# Altium schematic sheet Power.SchDoc
size Letter
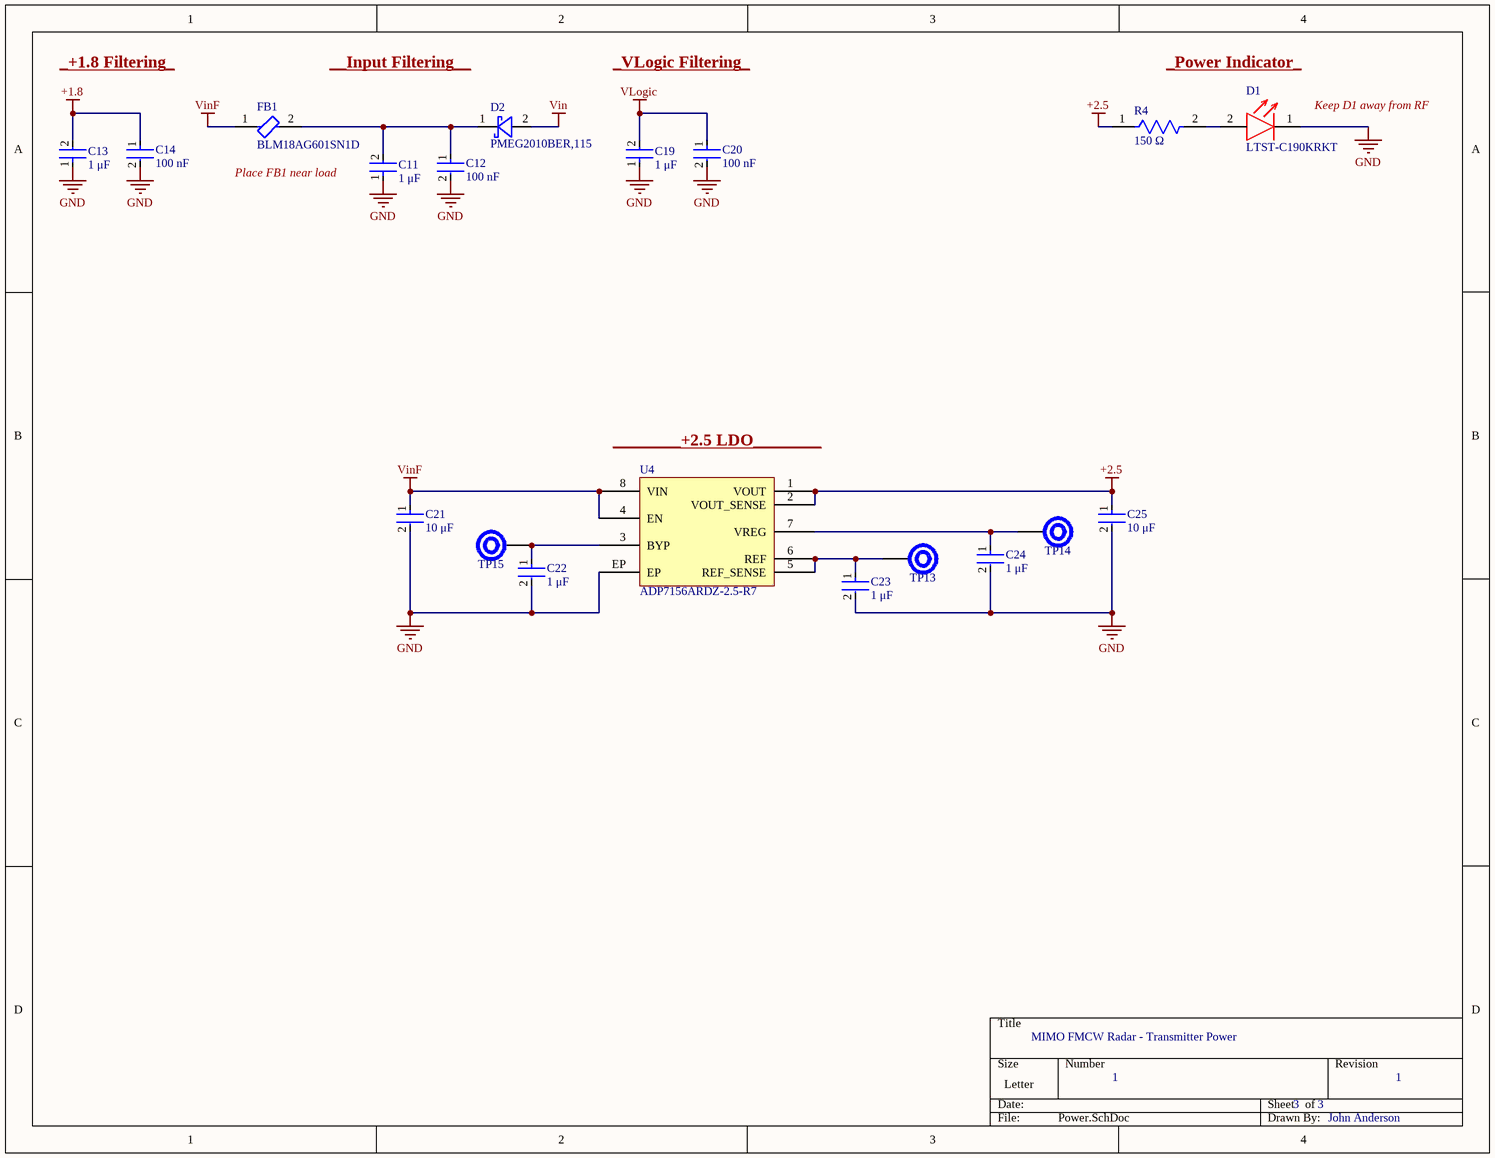
[diagram p0: Power.SchDoc]

## Parts
C11  1 μF  [FP-0603-L_1_6_0_15-W_0_8-MFG]
C12  100 nF  [FP-CGA3E-0_3-0_1-MFG]
C13  1 μF  [FP-0603-L_1_6_0_15-W_0_8-MFG]
C14  100 nF  [FP-CGA3E-0_3-0_1-MFG]
C19  1 μF  [FP-0603-L_1_6_0_15-W_0_8-MFG]
C20  100 nF  [FP-CGA3E-0_3-0_1-MFG]
C21  10 μF  [FP-GRM21B-0_15-IPC_C]
C22  1 μF  [FP-0603-L_1_6_0_15-W_0_8-MFG]
C23  1 μF  [FP-0603-L_1_6_0_15-W_0_8-MFG]
C24  1 μF  [FP-0603-L_1_6_0_15-W_0_8-MFG]
C25  10 μF  [FP-GRM21B-0_15-IPC_C]
D1  LTST-C190KRKT  [LTST-C190KRKT-Footprint-1]
D2  PMEG2010BER,115  [PMEG2010BER,115-Footprint-1]
FB1  BLM18AG601SN1D  [FP-BLM18-0_15-t0_8-IPC_B]
R4  150 Ω  [FP-RMCF0603-IPC_C]
TP13  Test Point - 32 mil  [Test Point - 32 mil-Footprint-1]  (value not drawn)
TP14  Test Point - 32 mil  [Test Point - 32 mil-Footprint-1]  (value not drawn)
TP15  Test Point - 32 mil  [Test Point - 32 mil-Footprint-1]  (value not drawn)
U4  ADP7156ARDZ-2.5-R7  [ADP7156ARDZ-2.5-R7-Footprint-1]

## Nets
+1.8: C13.2 C14.1
+2.5: C25.1 R4.1 U4.1(VOUT) U4.2(VOUT_SENSE)
GND: C11.1 C12.2 C13.1 C14.2 C19.1 C20.2 C21.2 C22.2 C23.2 C24.2 C25.2 D1.1 U4.EP
Vin: D2.2
VinF: C21.1 FB1.1 U4.4(EN) U4.8(VIN)
VLogic: C19.2 C20.1
NetC11_2: C11.2 C12.1 D2.1 FB1.2
NetC22_1: C22.1 TP15.1 U4.3(BYP)
NetC23_1: C23.1 TP13.1 U4.5(REF_SENSE) U4.6(REF)
NetC24_1: C24.1 TP14.1 U4.7(VREG)
NetD1_2: D1.2 R4.2

## Notes on the sheet
- _+1.8 Filtering_
- __Input Filtering__
- _VLogic Filtering_
- _Power Indicator_
- (near D1) Keep D1 away from RF
- Place FB1 near load
- (near U4) ________+2.5 LDO________
- MIMO FMCW Radar - Transmitter Power
- 1
- 3
- John Anderson

## Library data of the parts
C11 C13 C19 C22-C24 = CMP-00100-1: Ceramic Capacitor, Multilayer, Ceramic, 50V, 10% +Tol, 10% -Tol, X7R, 15% TC, 1uF, Surface Mount, 0603; Multilayer: Yes; Packaging: Tape and Reel; Dielectric Material: Ceramic; Terminal Finish: Tin; Min Operating Temperature: -55°C; Mounting Technology: Surface Mount; Pins: 2; Rated DC Voltage (URdc): 50V; Tolerance (fill in as +-): 10%; Package Style: SMTMeter; Length: 1.6mm; RoHS Compliant: Yes; Temperature Characteristics Code: X7R; Value: 1uF; Tolerance  (fill in as +-): 10%; Max Operating Temperature: 125°C; JESD-609 Code: e3; Package Shape: Rectangular; Termination: Wraparound; Reach SVHC Compliant: Yes; Case/Package: 0603; Width: 0.8mm; Capacitor Type: Ceramic; Height: 0.8mm
C12 C14 C20 = CMP-00054-1: Ceramic Capacitor, Multilayer, Ceramic, 50V, 10% +Tol, 10% -Tol, X7R, 15% TC, 0.1uF, Surface Mount, 0603; Reference Standard: AEC-Q200; Value: 100nF; Multilayer: Yes; Min Operating Temperature: -55°C; Reach SVHC Compliant: Yes; Case/Package: 0603; Width: 0.8mm; Dielectric Material: Ceramic; Pins: 2; JESD-609 Code: e3; Package Style: SMTMeter; Capacitor Type: Ceramic; Mounting Technology: Surface Mount; Tolerance  (fill in as +-): 10%; Max Operating Temperature: 125°C; Packaging: Tape and Reel; Tolerance (fill in as +-): 10%; Terminal Finish: Nickel; Termination: Wraparound; Height: 0.8mm; Temperature Characteristics Code: X7R; Rated DC Voltage (URdc): 50V; Length: 1.6mm; Package Shape: Rectangular; RoHS Compliant: Yes
C21 C25 = CMP-00053-1: Ceramic Capacitor, Multilayer, Ceramic, 25V, 20% +Tol, 20% -Tol, X5R, 15% TC, 10uF, Surface Mount, 0805; Multilayer: Yes; Rated DC Voltage (URdc): 25V; Package Style: SMTMeter; Terminal Finish: Nickel; RoHS Compliant: Yes; Package Shape: Rectangular; Reach SVHC Compliant: Yes; Pins: 2; Capacitor Type: Ceramic; Height: 1.25mm; Temperature Characteristics Code: X5R; Packaging: Tape and Reel; Min Operating Temperature: -55°C; JESD-609 Code: e3; Tolerance  (fill in as +-): 20%; Case/Package: 0805; Mounting Technology: Surface Mount; Length: 2mm; Max Operating Temperature: 85°C; Width: 1.25mm; Dielectric Material: Ceramic; Termination: Wraparound; Tolerance (fill in as +-): 20%; Value: 10uF
D1 = CMP-00109-2: Red, Single Color LED, Red, Water Clear; Luminous Intensity-Nom: 54mcd; Channels: 1; Shape: Rectangular; Forward Current: 30mA; Forward Voltage: 2.4V; Luminous Intensity-Min: 130cd; Overall Height: 0.8mm; Viewing Angle: 130°; Reverse Voltage-Max: 5V; Color@wavelength: Red; RoHS Compliant: Yes; Lens Style: WATER CLEAR; Size: 1.1mm; Max Operating Temperature: 85°C; Reach SVHC Compliant: Yes; Packaging: Tape and Reel; Optoelectronic Device Type: SINGLE COLOR LED; Color: Red; Pins: 2; Terminal Pitch: 1.5mm; Mounting Technology: Surface Mount; Min Operating Temperature: -30°C
D2 = CMP-00387-1: PMEG2010 Series 20 V 1 A SMT Low VF MEGA Schottky Barrier Rectifier - SOD-123W; Manufacturer Lifecycle Status: RELEASED FOR SUPPLY; Average Rectified Current: 1A; Max Repetitive Reverse Voltage (Vrrm): 20V; Number of Elements: 1; Max Forward Surge Current (Ifsm): 50A; Max Power Dissipation: 1.8W; Forward Voltage: 340mV; Max Reverse Leakage Current: 50µA; Element Configuration: Single; Contact Plating: Tin; REACH SVHC: No; Schedule B: 8541100050; Radiation Hardening: No; Max Output current: 1A; Mounting Technology: Surface Mount; Lead Free: Lead Free; RoHS: Compliant; Number of Terminals: 2; Introduction Date: 2009-04-22; Country of Origin: Mainland China; Max Reverse Voltage (DC): 20V; Pins: 2; Max Operating Temperature: 150°C; Max Surge Current: 50A; Forward Current: 1A; Harmonized Tariff Schedule (HTS) Code: 8541.10.00.80; Peak Non-Repetitive Surge Current: 50A; Export Control Classification Number (ECCN) Code: EAR99; Reverse Standoff Voltage: 20V; Peak Reverse Current: 50µA; Min Operating Temperature: -55°C; Lifecycle Status: Production
FB1 = CMP-00321-1: Ferrite Beads Multi-Layer 600Ohm 25% 100MHz 500mA 380mOhm DCR 0603 Automotive Paper T/R; DC Resistance (DCR): 380mΩ; Material: Ferrite, Steel; Number of Circuits: 1; Value: 380mΩ; Impedance: 600Ω; Shielding: Unshielded; Core Material: Ferrite; Radiation Hardening: No; Width: 800µm; Height: 800µm; Max Operating Temperature: 125°C; Packaging: Cut Tape; Max DC Current: 500mA; Depth: 800µm; RoHS: Compliant; Country of Origin: Japan, Thailand; Number of Terminals: 2; Termination: SMD/SMT; REACH SVHC: Yes; Pins: 2; Weight: 2.012816mg; Case/Package: 0603; Test Frequency: 100MHz; Introduction Date: 2001-08-28; DC Current: 500mA; Lifecycle Status: Production; Case Code (Metric): 1608; Military Standard: Not; Frequency: 100MHz; Tolerance: 25%; Schedule B: 8543706000, 8543706000; Current Rating: 500mA; Max Current Rating: 500mA; Export Control Classification Number (ECCN) Code: EAR99; Harmonized Tariff Schedule (HTS) Code: 8504.50.80.00; ESR: 380mΩ; Clock Frequency: 100MHz; RMS Current (Irms): 500mA; Min Operating Temperature: -55°C; Length: 1.6mm; Lead Free: Lead Free; Number of Lines: 1; Case Code (Imperial): 0603
R4 = CMP-00177-1: 150 Ohm, Res Thick Film 0603 1% 0.1W ±100ppm/°C Molded SMD Paper T/R; Working Voltage: 75V; Power Rating: 100mW; Value: 150Ω; Case Code (Metric): 1608; Mounting Technology: Surface Mount; China RoHS: Non-Compliant; Number of Terminals: 2; Min Operating Temperature: -55°C; Lifecycle Status: Production; Temperature Coefficient: 100ppm/°C; Case Code (Imperial): 0603; Length: 1.5494mm; Packaging: Cut Tape (CT); Case/Package: 0603; Features: Automotive AEC-Q200; Schedule B: 8533210045, 8533210045; Max Power Dissipation: 100mW; Composition: Thick Film; Max Operating Temperature: 155°C; RoHS: Compliant; Width: 800µm; Tolerance: 1%; Voltage Rating: 75V; REACH SVHC: Yes; Lead Free: Lead Free; Power Dissipation: 100mW; Height: 450µm; Number of Terminations: 2; Contact Plating: Tin; Radiation Hardening: No
TP13-TP15 = CMP-00284-1: 32 mil (0.8 mm) test point.
U4 = CMP-00386-1: LDO Regulator Pos 2.5V 1.2A 8-Pin SOIC N EP T/R; Manufacturer Lifecycle Status: PRODUCTION; Min Current Limit: 1.4A; Polarity: Positive; Min Supply Voltage: 3V; Quiescent Current: 8mA; Number of Regulators: 1; Dropout Voltage: 120mV; Accuracy: 0.6%; Max Supply Voltage: 5.5V; Min Input Voltage: 2.3V; Output Type: Fixed; Max Junction Temperature (Tj): 125°C; REACH SVHC: No; Packaging: Cut Tape; Case/Package: SOIC; Lead Free: Contains Lead; Height: 1.75mm; Output Current: 1.2A; Nominal Output Voltage: 2.5V; Output Voltage: 2.5V; Lifecycle Status: Production; Min Operating Temperature: -40°C; Max Output current: 1.2A; Contact Plating: Tin; Number of Outputs: 1; RoHS: Compliant; Pins: 8; Schedule B: 8542390000, 8542390000; Mounting Technology: Surface Mount; Max Operating Temperature: 125°C